# EAGLE schematic ignitor (EAGLE 7.6.0)
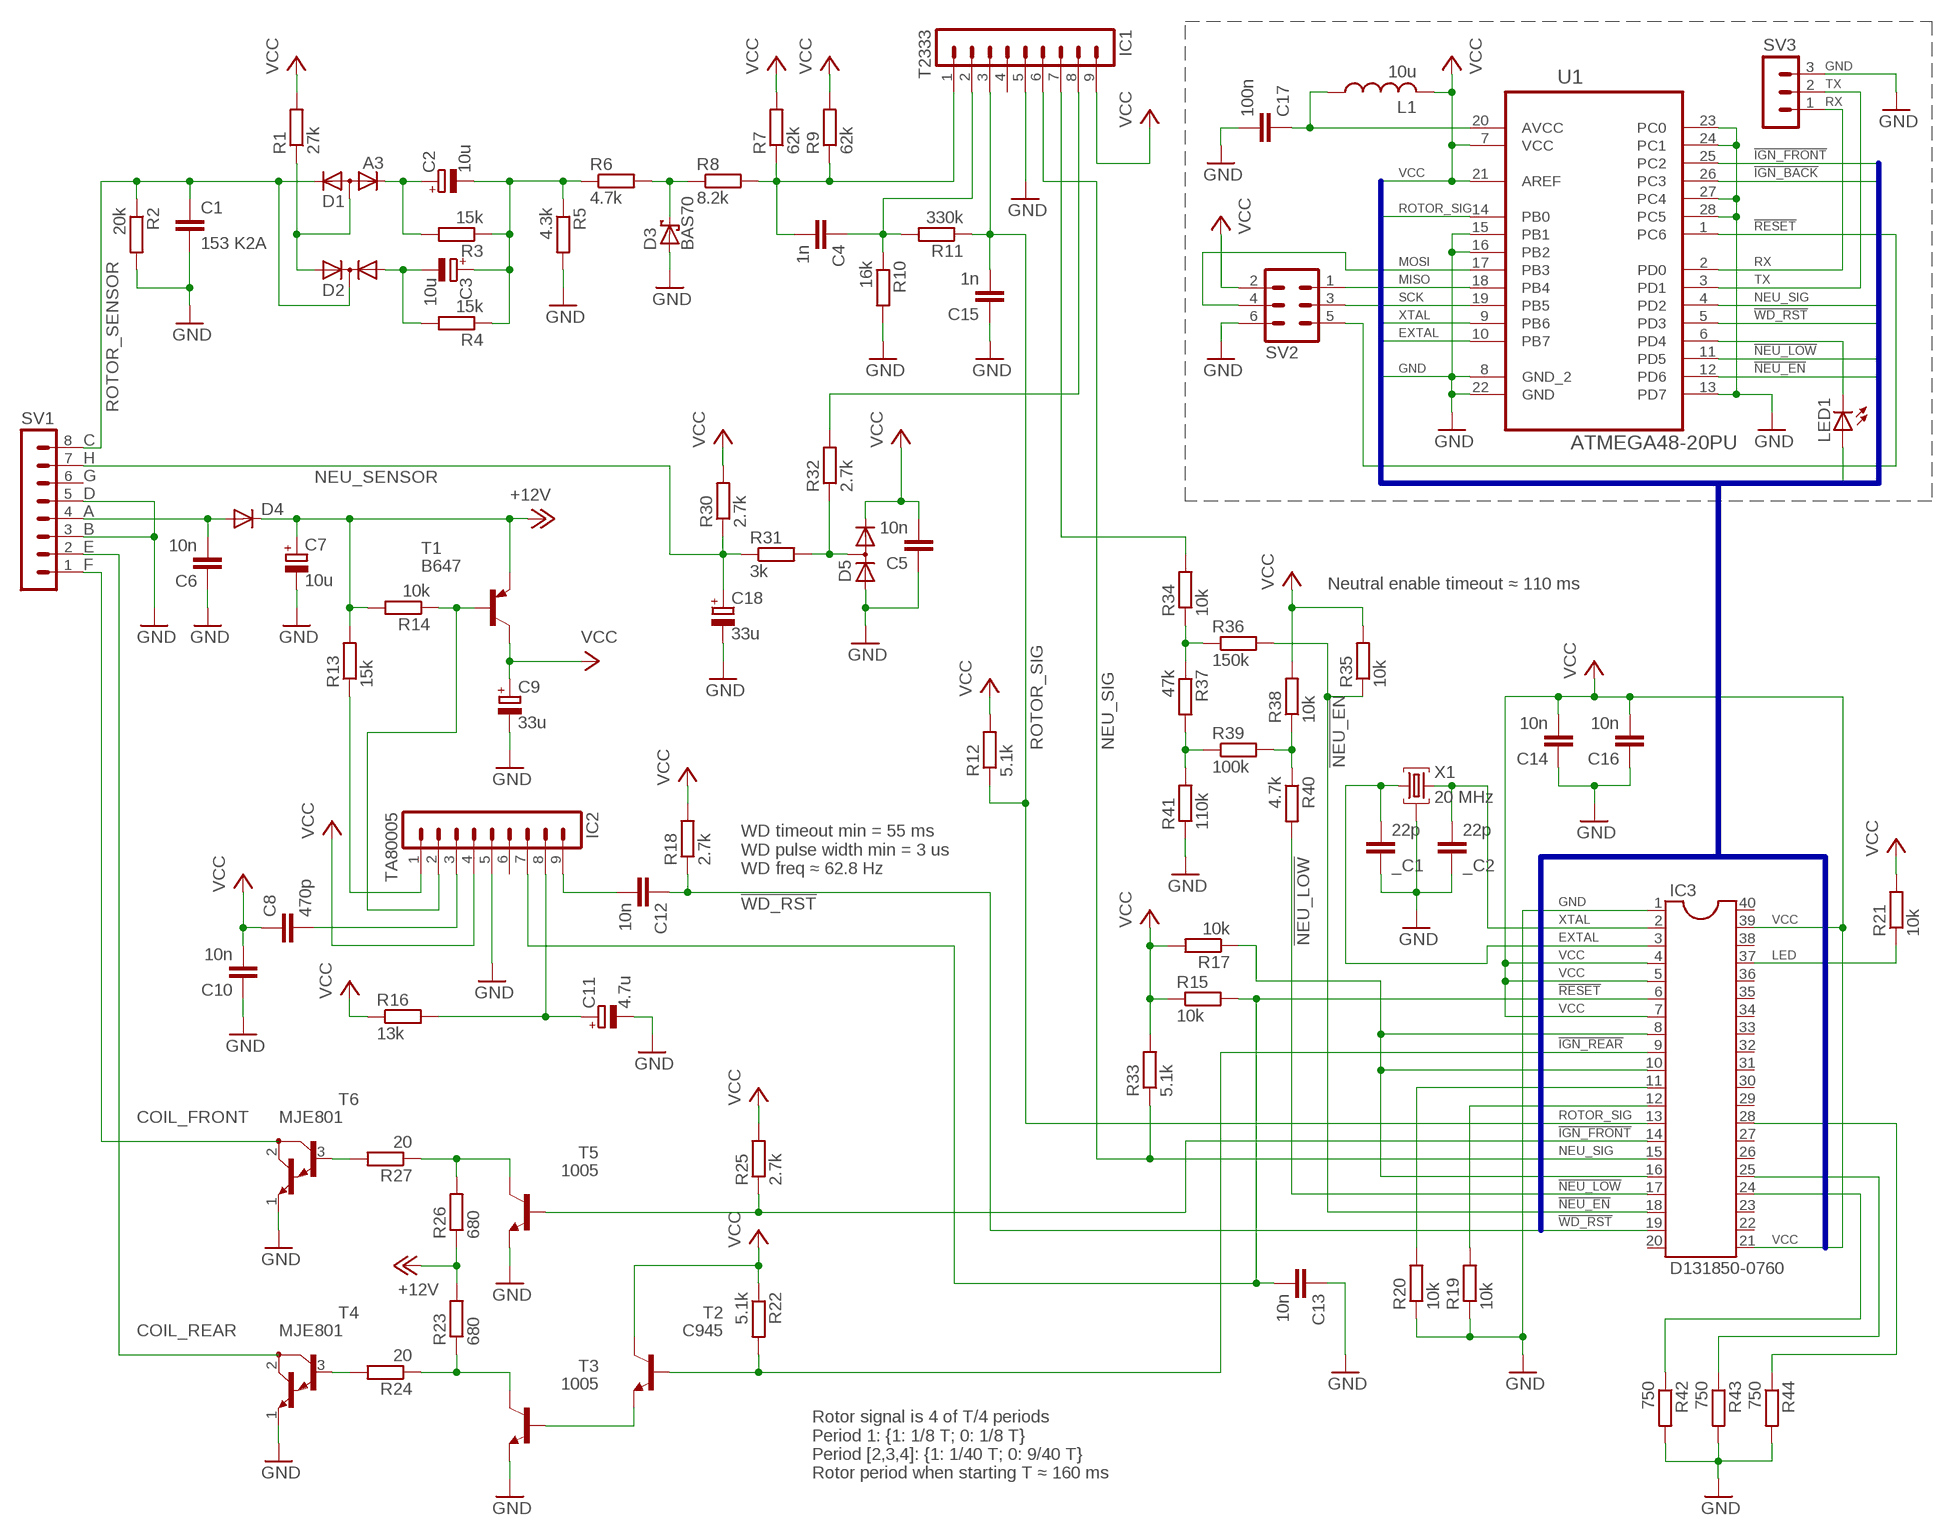
[diagram p0: schematic, sheet 1]

## Parts
_C1  22p  C-EUC0805  [C0805]
_C2  22p  C-EUC0805  [C0805]
C1  153 K2A  C-EU050-030X075  [C050-030X075]
C2  10u  CPOL-EUE2.5-5  [E2,5-5]
C3  10u  CPOL-EUE2.5-5  [E2,5-5]
C4  1n  C-EUC0805  [C0805]
C5  10n  C-EUC0805  [C0805]
C6  10n  C-EUC0805  [C0805]
C7  10u  CPOL-EUE2.5-5  [E2,5-5]
C8  470p  C-EUC0805  [C0805]
C9  33u  CPOL-EUE2.5-5  [E2,5-5]
C10  10n  C-EUC0805  [C0805]
C11  4.7u  CPOL-EUE2.5-5  [E2,5-5]
C12  10n  C-EUC0805  [C0805]
C13  10n  C-EUC0805  [C0805]
C14  10n  C-EUC0805  [C0805]
C15  1n  C-EUC0805  [C0805]
C16  10n  C-EUC0805  [C0805]
C17  100n  C-EU050-024X044  [C050-024X044]
C18  33u  CPOL-EUE2.5-5  [E2,5-5]
D1  A3  DIODE-2CA|ACSOT23  [SOT23]
D2  DIODE-2AC|CASOT23  [SOT23]
D3  BAS70  [SOT23]
D4  DIODE-MINIMELF  [MINIMELF]
D5  DIODE_2CACA-SOT23  [SOT23]
IC1  T2333  MA09-1  [MA09-1]
IC2  TA80005  MA09-1  [MA09-1]
IC3  D131850-0760  DIL40  [DIL40]
L1  10u  L-US0204/5  [0204/5]
LED1  LED3MM  [LED3MM]
R1  27k  R-EU_R0805  [R0805]
R2  20k  R-EU_R0805  [R0805]
R3  15k  R-EU_R0805  [R0805]
R4  15k  R-EU_R0805  [R0805]
R5  4.3k  R-EU_R0805  [R0805]
R6  4.7k  R-EU_R0805  [R0805]
R7  62k  R-EU_R0805  [R0805]
R8  8.2k  R-EU_R0805  [R0805]
R9  62k  R-EU_R0805  [R0805]
R10  16k  R-EU_R0805  [R0805]
R11  330k  R-EU_R0805  [R0805]
R12  5.1k  R-EU_R0805  [R0805]
R13  15k  R-EU_R0805  [R0805]
R14  10k  R-EU_R0805  [R0805]
R15  10k  R-EU_R0805  [R0805]
R16  13k  R-EU_R0805  [R0805]
R17  10k  R-EU_R0805  [R0805]
R18  2.7k  R-EU_R0805  [R0805]
R19  10k  R-EU_R0805  [R0805]
R20  10k  R-EU_R0805  [R0805]
R21  10k  R-EU_R0805  [R0805]
R22  5.1k  R-EU_R0805  [R0805]
R23  680  R-EU_R2512  [R2512]
R24  20  R-EU_R0805  [R0805]
R25  2.7k  R-EU_R0805  [R0805]
R26  680  R-EU_R2512  [R2512]
R27  20  R-EU_R0805  [R0805]
R30  2.7k  R-EU_R0805  [R0805]
R31  3k  R-EU_R0805  [R0805]
R32  2.7k  R-EU_R0805  [R0805]
R33  5.1k  R-EU_R0805  [R0805]
R34  10k  R-EU_R0805  [R0805]
R35  10k  R-EU_R0805  [R0805]
R36  150k  R-EU_R0805  [R0805]
R37  47k  R-EU_R0805  [R0805]
R38  10k  R-EU_R0805  [R0805]
R39  100k  R-EU_R0805  [R0805]
R40  4.7k  R-EU_R0805  [R0805]
R41  110k  R-EU_R0805  [R0805]
R42  750  R-EU_R0805  [R0805]
R43  750  R-EU_R0805  [R0805]
R44  750  R-EU_R0805  [R0805]
SV1  MA08-1  [MA08-1]
SV2  MA03-2  [MA03-2]
SV3  MA03-1  [MA03-1]
T1  B647  -PNP-TO92  [TO92]
T2  C945  -NPN-TO92  [TO92]
T3  1005  -NPN-TO92  [TO92]
T4  MJE801  [TO126]
T5  1005  -NPN-TO92  [TO92]
T6  MJE801  [TO126]
U1  ATMEGA48-20PU  [DIP254P762X457-28]
X1  20 MHz  12M10AHC49HT  [HC49U]

## Nets
!IGN_BACK: U1.26(PC3)
!IGN_FRONT: IC3.14 R25.1 T5.2(B) U1.25(PC2)
!IGN_REAR: IC3.9 R22.2 T2.2(B)
!NEU_EN: IC3.18 R35.1 R36.2 U1.12(PD6)
!NEU_LOW: IC3.17 R40.2 U1.11(PD5)
!RESET: C13.2 IC2.7 IC3.6 R15.2 SV2.5 U1.1(PC6)
!WD_RST: C12.1 IC3.19 R18.1 U1.5(PD3)
+12V: C7.+ D4.C R13.2 R14.2 R23.2 R26.1 T1.1(E)
COIL_FRONT: SV1.1 T6.2(C)
COIL_REAR: SV1.2 T4.2(C)
EXTAL: _C1.2 IC3.3 U1.10(PB7) X1.1
GND: _C1.1 _C2.1 C1.2 C5.1 C6.1 C7.- C9.- C10.1 C11.- C13.1 C14.1 C15.1 C16.1 C17.2 C18.- D3.1(A) D5.1(A) IC1.5 IC2.5 IC3.1 R2.2 R5.2 R10.2 R19.1 R20.1 R41.1 R42.2 R43.2 R44.2 SV1.3 SV1.5 SV2.6 SV3.3 T3.1(E) T4.1(E) T5.1(E) T6.1(E) U1.8(GND_2) U1.13(PD7) U1.15(PB1) U1.16(PB2) U1.22(GND) U1.23(PC0) U1.24(PC1) U1.27(PC4) U1.28(PC5) X1.2
LED: IC3.37 LED1.A R21.1
MISO: SV2.1 U1.18(PB4)
MOSI: SV2.4 U1.17(PB3)
N$1: R27.2 T6.3(B)
N$2: C12.2 IC2.9
N$3: D1.3(A) D2.2(A2) R1.1
N$4: C3.- D2.1(A1) R4.2
N$5: C2.- C3.+ R3.1 R4.1 R5.1 R6.1
N$6: C2.+ D1.1(K1) R3.2
N$7: LED1.K(C) U1.6(PD4)
N$8: C17.1 L1.1 U1.20(AVCC)
N$9: D3.3(C) R6.2 R8.1
N$10: C4.2 IC1.1 R7.1 R8.2 R9.1
N$11: C4.1 IC1.2 R10.1 R11.2
N$12: D5.3(AC) R31.2 R32.1
N$13: R34.1 R36.1 R37.1
N$14: R37.2 R39.1 R41.2
N$15: IC1.7 R34.2
N$20: C6.2 D4.A SV1.4
N$23: IC2.2 R14.1 T1.2(B)
N$24: C8.2 IC2.3
N$26: IC2.1 R13.1
N$27: C11.+ IC2.8 R16.2
N$29: T2.1(E) T3.2(B)
N$31: R24.2 T4.3(B)
N$32: R26.2 R27.1 T5.3(C)
N$33: R23.1 R24.1 T3.3(C)
N$34: IC3.12 R19.2
N$39: IC3.8 IC3.10 IC3.16 R17.1
N$40: IC3.24 R42.1
N$41: IC3.11 R20.2
N$42: IC3.28 R44.1
N$43: IC3.25 R43.1
N$45: R38.1 R39.2 R40.1
N$47: IC1.8 R32.2
NEU_SENSOR: C18.+ R30.1 R31.1 SV1.7
NEU_SIG: IC1.6 IC3.15 R33.1 U1.4(PD2)
ROTOR_SENSOR: C1.1 D1.2(K2) D2.3(C) R2.1 SV1.8
ROTOR_SIG: C15.2 IC1.3 IC3.13 R11.1 R12.1 U1.14(PB0)
RX: SV3.1 U1.2(PD0)
SCK: SV2.3 U1.19(PB5)
TX: SV3.2 U1.3(PD1)
VCC: C5.2 C8.1 C9.+ C10.2 C14.2 C16.2 D5.2(C) IC1.9 IC2.4 IC3.4 IC3.5 IC3.7 IC3.21 IC3.39 L1.2 R1.2 R7.2 R9.2 R12.2 R15.1 R16.1 R17.2 R18.2 R21.2 R22.1 R25.2 R30.2 R33.2 R35.2 R38.2 SV2.2 T1.3(C) T2.3(C) U1.7(VCC) U1.21(AREF)
XTAL: _C2.2 IC3.2 U1.9(PB6) X1.3
Unconnected: IC1.4 IC2.6 IC3.20 IC3.22 IC3.23 IC3.26 IC3.27 IC3.29 IC3.30 IC3.31 IC3.32 IC3.33 IC3.34 IC3.35 IC3.36 IC3.38 IC3.40 SV1.6

## Buses
B$1

## Notes on the sheet
- C
- H
- G
- D
- A
- B
- E
- F
- Neutral enable timeout ≈ 110 ms
- WD timeout min = 55 ms
  WD pulse width min = 3 us
  WD freq ≈ 62.8 Hz
- Rotor signal is 4 of T/4 periods
  Period 1: {1: 1/8 T; 0: 1/8 T}
  Period [2,3,4]: {1: 1/40 T; 0: 9/40 T}
  Rotor period when starting T ≈ 160 ms

## Library data of the parts
_C1 _C2 C1 C4-C6 C8 C10 C12-C17 = resistor:C-EU: CAPACITOR, European symbol
C2 C3 C7 C9 C11 C18 = resistor:CPOL-EU: POLARIZED CAPACITOR, European symbol
D1 = diode:DIODE-2CA|AC: Dual DIODE Cathode-Anode|Anode-Cathode
D2 = diode:DIODE-2AC|CA: Dual DIODE Anode-Cathode|Cathode-Anode
D3 = diode:BAS70: Silicon Schottky Diodes General-purpose diode for high-speed switching
D4 = diode:DIODE-: DIODE
D5 = diode:DIODE_2CACA-: 2 Diodes - Cathode-Anode|Cathode-Anode
IC1 IC2 = con-lstb:MA09-1: PIN HEADER; OC_FARNELL: unknown; OC_NEWARK: unknown
IC3 = ic-package:DIL40: Dual In Line
L1 = resistor:L-US: INDUCTOR, American symbol
LED1 = led:LED: LED OSRAM: - CHIPLED LG R971, LG N971, LY N971, LG Q971, LY Q971, LO R971, LY R971 LH N974, LH R974 LS Q976, LO Q976, LY Q976 LO Q996 - Hyper CHIPLED LW Q18S LB Q993, LB Q99A, LB R99A - SideLED LS A670, LO A670, LY A670, LG A670, LP A670 LB A673, LV A673, LT A673, LW A673 LH A674 LY A675 LS A676, LA A676, LO A676, LY A676, LW A676 LS A679, LY A679, LG A679 - Hyper Micro SIDELED® LS Y876, LA Y876, LO Y876, LY Y876 LT Y87S - SmartLED LW L88C, LW L88S LB L89C, LB L89S, LG L890 LS L89K, LO L89K, LY L89K LS L896, LA L896, LO L896, LY L896 - TOPLED LS T670, LO T670, LY T670, LG T670, LP T670 LSG T670, LSP T670, LSY T670, LOP T670, LYG T670 LG T671, LOG T671, LSG T671 LB T673, LV T673, LT T673, LW T673 LH T674 LS T676, LA T676, LO T676, LY T676, LB T676, LH T676, LSB T676, LW T676 LB T67C, LV T67C, LT T67C, LS T67K, LO T67K, LY T67K, LW E67C LS E67B, LA E67B, LO E67B, LY E67B, LB E67C, LV E67C, LT E67C LW T67C LS T679, LY T679, LG T679 LS T770, LO T770, LY T770, LG T770, LP T770 LB T773, LV T773, LT T773, LW T773 LH T774 LS E675, LA E675, LY E675, LS T675 LS T776, LA T776, LO T776, LY T776, LB T776 LHGB T686 LT T68C, LB T68C - Hyper Mini TOPLED® LB M676 - Mini TOPLED Santana® LG M470 LS M47K, LO M47K, LY M47K Source: http://www.osram.convergy.de LUXEON: - LUMILED® LXK2-PW12-R00, LXK2-PW12-S00, LXK2-PW14-U00, LXK2-PW14-V00 LXK2-PM12-R00, LXK2-PM12-S00, LXK2-PM14-U00 LXK2-PE12-Q00, LXK2-PE12-R00, LXK2-PE12-S00, LXK2-PE14-T00, LXK2-PE14-U00 LXK2-PB12-K00, LXK2-PB12-L00, LXK2-PB12-M00, LXK2-PB14-N00, LXK2-PB14-P00, LXK2-PB14-Q00 LXK2-PR12-L00, LXK2-PR12-M00, LXK2-PR14-Q00, LXK2-PR14-R00 LXK2-PD12-Q00, LXK2-PD12-R00, LXK2-PD12-S00 LXK2-PH12-R00, LXK2-PH12-S00 LXK2-PL12-P00, LXK2-PL12-Q00, LXK2-PL12-R00 Source: www.luxeon.com KINGBRIGHT: KA-3528ASYC Source: www.kingbright.com
R1-R27 R30-R44 = resistor:R-EU_: RESISTOR, European symbol
SV1 = con-lstb:MA08-1: PIN HEADER; OC_FARNELL: unknown; OC_NEWARK: unknown
SV2 = con-lstb:MA03-2: PIN HEADER; OC_FARNELL: unknown; OC_NEWARK: unknown
SV3 = con-lstb:MA03-1: PIN HEADER; OC_FARNELL: unknown; OC_NEWARK: unknown
T1 = transistor:*-PNP-: PNP Transistror
T2 T3 T5 = transistor:*-NPN-: NPN Transistror BF959 corrected 2008.03.06
T4 T6 = transistor:MJE801: NPN BIPOLAR DARLINGTON TRANSISTOR
U1 = Atmel_By_element14_Batch_1-00:ATMEGA48-20PU: 8-bit MCU; MPN: ATMEGA48-20PU; OC_FARNELL: 9171320; OC_NEWARK: 96K6518; PACKAGE: DIP-28; SUPPLIER: Atmel
X1 = crystal:12M10AHC49HT: Monolithic Crystal Filters Source: www.vanlong.com; OC_FARNELL: unknown; OC_NEWARK: unknown